# Altium schematic sheet sensor.SchDoc
size A4
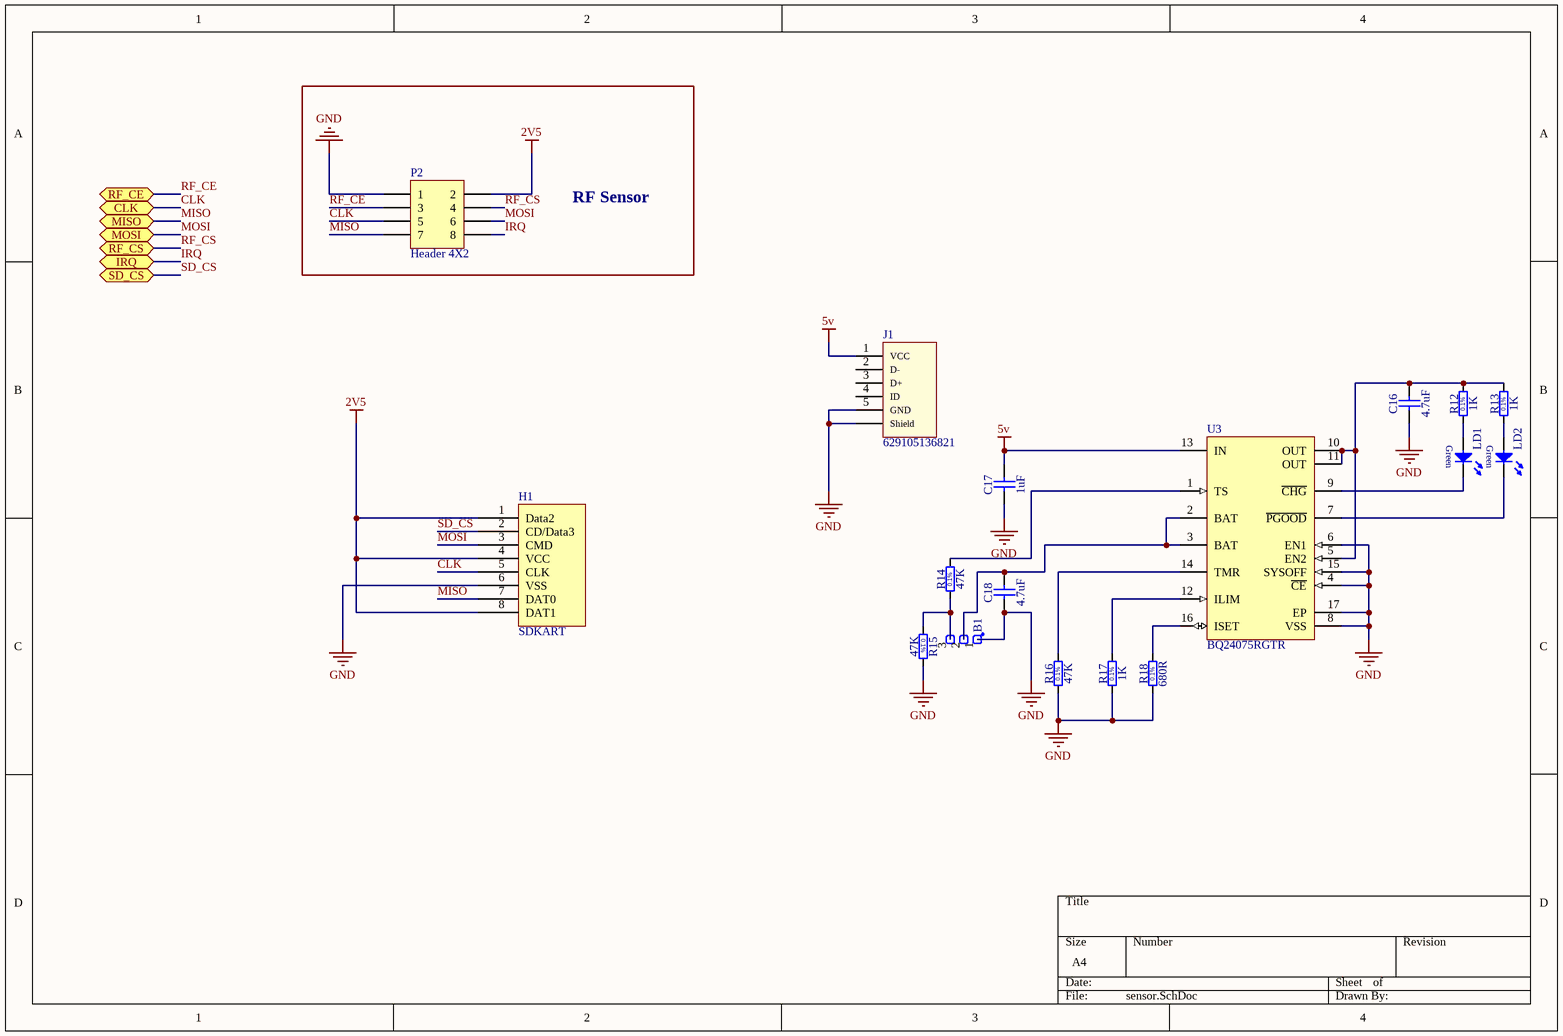
[diagram p0: sensor.SchDoc]

## Parts
B1  Test Point  [COMATEL_331.0600.1.03.500]  (value not drawn)
C16  4.7uF  [CAPC2012X135N]
C17  1uF  [CAPC2012X135N]
C18  4.7uF  [CAPC2012X135N]
H1  SDKART  [PCBComponent_1]
J1  629105136821  [629105136821]
LD1  Green  [LED_OSRAM_LGR971]  (value not drawn)
LD2  Green  [LED_OSRAM_LGR971]  (value not drawn)
P2  Header 4X2  [HDR2X4]
R12  1K  [RESC2012X60N]
R13  1K  [RESC2012X60N]
R14  47K  [RESC2012X60N]
R15  47K  [RESC2012X60N]
R16  47K  [RESC2012X60N]
R17  1K  [RESC2012X60N]
R18  680R  [RESC2012X60N]
U3  BQ24075RGTR  [RGT16-1700X1700TP]

## Blocks framed on the sheet
RF Sensor: P2

## Ports
CLK, IRQ, MISO, MOSI, RF_CE, RF_CS, SD_CS

## Nets
2V5: H1.1(Data2) H1.4(VCC) H1.8(DAT1) P2.2
5v: C17.2 J1.1(VCC) U3.13(IN)
GND: B1.1 C16.1 C17.1 C18.1 H1.6(VSS) J1.5(GND) J1.Shell(Shield) P2.1 R15.2 R16.1 R17.1 R18.1 U3.4(~{CE}) U3.6(EN1) U3.8(VSS) U3.15(SYSOFF) U3.17(EP)
CLK: H1.5(CLK) P2.5 ; port CLK
IRQ: P2.8 ; port IRQ
MISO: H1.7(DAT0) P2.7 ; port MISO
MOSI: H1.3(CMD) P2.6 ; port MOSI
RF_CE: P2.3 ; port RF_CE
RF_CS: P2.4 ; port RF_CS
SD_CS: H1.2(CD/Data3) ; port SD_CS
NetB1_2: B1.2 C18.2 U3.2(BAT) U3.3(BAT)
NetB1_3: B1.3 R14.1 R15.1
NetC16_2: C16.2 R12.2 R13.2 U3.5(EN2) U3.10(OUT) U3.11(OUT)
NetLD1_1: LD1.1(C) U3.9(~{CHG})
NetLD1_2: LD1.2(A) R12.1
NetLD2_1: LD2.1(C) U3.7(~{PGOOD})
NetLD2_2: LD2.2(A) R13.1
NetR14_2: R14.2 U3.1(TS)
NetR16_2: R16.2 U3.14(TMR)
NetR17_2: R17.2 U3.12(ILIM)
NetR18_2: R18.2 U3.16(ISET)

Not connected (* = marked no-connect by the designer): J1 2(D-) 3(D+) 4(ID)

## Notes on the sheet
- (in symbol R0805_1K1_0.1%_0.1W_10PPM) 0.1%

## Library data of the parts
B1 = COMATEL_331.0600.1.03.500: 3 Positions Terminal Strip; Part Description: 3 "U" Pins Strip Terminals Components Support, Pitch 2.54mm; Manufacturer: KONTEK COMATEL; Table: STELVIO-KONTEK COMATEL; Part Number: COMATEL_331.0600.1.03.500; Component Kind: Standard; Component Type: Standard; Pin Count: 3; Family: Test Point; Mounted: Yes; Socket: No; SMD: No; Status: Obsolete; Manufacturer Part Number: 331.0600.1.03.500; ComponentHeight: 5.7mm; HelpURL: \\cern.ch\dfs\Applications\Altium\Datasheets\COMATEL_331.0600.1.03.500.pdf; Author: CERN DEM JLC; CreateDate: 16.12.2010; LatestRevisionDate: 27.08.2013
C16-C18 = CC0805_10NF_50V_10%_X7R: Non-polarised capacitor; Part Description: SMD Multilayer Chip Ceramic Capacitor; Manufacturer: GENERIC; Manufacturer1 Part Number: B37941K5103K60; Voltage: 50V; TC: X7R; Tolerance: ±10%; Table: Capacitors SMD; Part Number: CC0805_10NF_50V_10%_X7R; Component Kind: Standard; Component Type: Standard; Pin Count: 2; Status: Preferred; Manufacturer Part Number: CC0805_10NF_50V_10%_X7R; Case: 0805; Mounted: Yes; Socket: No; SMD: Yes; Manufacturer1 Example: EPCOS; Manufacturer1 ComponentHeight: 1.35mm; HelpURL: \\cern.ch\dfs\Applications\Altium\Datasheets\CC0805_X7R_EPCOS.pdf; Author: CERN DEM JLC; CreateDate: 03.12.2007; LatestRevisionDate: 03.12.2007
  C16 C18: Value: 4.7uF
  C17: Value: 1uF
J1 = 629105136821: Micro USB 2.0 SMT Type B Horizontal 5 Contacts WR-COM; Interface Type: Type B; Gender: Receptacle; ComponentLink1Description: Manufacturer; ComponentLink1URL: http://www.we-online.de; ComponentLink2Description: Datasheet; ComponentLink2URL: http://katalog.we-online.de/em/datasheet/629105136821.pdf; Part Number: 629105136821; Published Date: April 2017; Publisher: Wurth Elektronik; Sub-Family: Micro USB 2.0; Type: Horizontal; Construction: SMT
LD1 LD2 = LED_OSRAM_LGR971: LED Green 1C 2A; Part Description: Surface Mount Green LED (0805 Case); Manufacturer: OSRAM; Manufacturer Part Number: LGR971; Table: LEDs & Displays; Part Number: LED_OSRAM_LGR971; Component Kind: Standard; Component Type: Standard; Color: Green; PackageDescription: Green Chip LED, 2-Leads, Body 2.0x1.25mm, IPC Medium Density; Pin Count: 2; Case: 0805; Mounted: Yes; Socket: No; SMD: Yes; ComponentHeight: 0.9mm; HelpURL: \\cern.ch\dfs\Applications\Altium\Datasheets\LED_OSRAM_LGR971.pdf; Author: CERN DEM JLC; CreateDate: 28.01.2009; LatestRevisionDate: 17.03.2010
P2 = Header 4X2: Header, 4-Pin, Dual row; LatestRevisionDate: 17-Jul-2002; LatestRevisionNote: Re-released for DXP Platform.; Publisher: Altium Limited
R12-R18 = R0805_1K1_0.1%_0.1W_10PPM: Resistor - 0.1%; Part Description: Thin Film Chip Resistor; Manufacturer: GENERIC; Manufacturer1 Part Number: RN73C2A1K1BTG; Power: 0.1W; TC: ±10ppm; Table: Resistors SMD; Part Number: R0805_1K1_0.1%_0.1W_10PPM; Component Kind: Standard; Component Type: Standard; Pin Count: 2; Status: Not recommended; Tolerance: ±0.1%; Manufacturer Part Number: R0805_1K1_0.1%_0.1W_10PPM; Case: 0805; Mounted: Yes; Socket: No; SMD: Yes; Manufacturer1 Example: TYCO HOLSWORTHY; Manufacturer1 ComponentHeight: 0.6mm; HelpURL: \\cern.ch\dfs\Applications\Altium\Datasheets\R0805_Tyco_RN73.pdf; Author: CERN DEM JLC; CreateDate: 03.12.2007; LatestRevisionDate: 13.03.2008
  R12 R13 R17: Value: 1K
  R14-R16: Value: 47K
  R18: Value: 680R
U3 = BQ24075RGTR: USB-Friendly Li-Ion Battery Charger and Power-Path Management IC, Vout 5.5 V, 4.3 V, -40 to 85 degC, 16-pin QFN (RGT), Green (RoHS & no Sb/Br); Manufacturer: Texas Instruments; Lead Acid: N; SubFamily: Battery Charge Management; Vin(Min)(V): 4.3; DatasheetVersion: SLUS810G; PackageVersion: revH, Oct-2011; PackageReference: RGT16-1700X1700TP; PackageDescription: 16-Pin Plastic Quad Flat No-Lead, 3 x 3 mm Body, 0.5 mm Pitch, 1.7 x 1.7 mm Exposed Pad; Supplier 1: Digi-Key; Supplier Part Number 1: BQ24075RGTR-ND; Supplier 2: Newark; Supplier Part Number 2: 31P7535; Supplier 3: Mouser; Supplier Part Number 3: 595-BQ24075RGTR; Eco-Plan: Green (RoHS & no Sb/Br); Li-Ion: N; Li-Polymer: N; NiCd: N; NiMH: N; Over Voltage Protection: N; Mounting Technology: Surface Mount; PartNumber: BQ24075RGTR; Code_JEDEC: MO-220; ComponentLink1Description: Datasheet; ComponentLink1URL: http://www.ti.com/general/docs/lit/getliterature.tsp?genericPartNumber=BQ24075&fileType=pdf